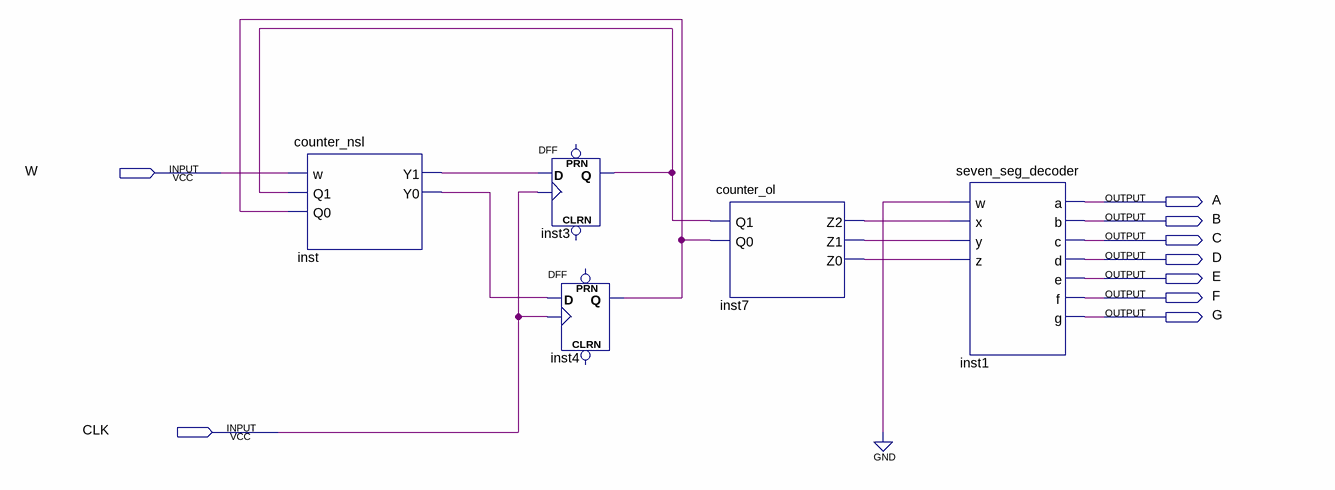
[diagram p0: schematic sheet]
// Quartus schematic lab11step1.bdf as structural Verilog: 5 symbols, 9 pins
module lab11step1 (
  input  W,
  input  CLK,
  output A,
  output B,
  output C,
  output D,
  output E,
  output F,
  output G
);

  wire inst3_q, inst4_q, inst7_z0, inst7_z1, inst7_z2, inst_y0, inst_y1;

  counter_nsl inst (.w(W), .Q1(inst3_q), .Q0(inst4_q), .Y1(inst_y1), .Y0(inst_y0));
  DFF inst3 (.CLK(CLK), .D(inst_y1), .Q(inst3_q));  // open: CLRN, PRN
  DFF inst4 (.CLK(CLK), .D(inst_y0), .Q(inst4_q));  // open: CLRN, PRN
  counter_ol inst7 (.Q1(inst3_q), .Q0(inst4_q), .Z2(inst7_z2), .Z1(inst7_z1), .Z0(inst7_z0));
  seven_seg_decoder inst1 (
    .w(1'b0), .x(inst7_z2), .y(inst7_z1), .z(inst7_z0), .a(A), .b(B), .c(C), .d(D), .e(E), .f(F), .g(G));
endmodule
